# Altium schematic sheet top.SchDoc
size A4
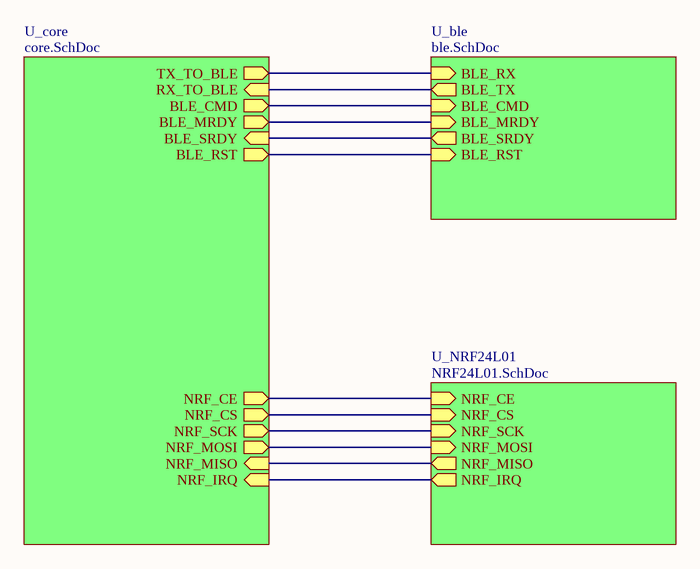
[diagram p0: top.SchDoc]

## Sub-sheets
U_ble = ble.SchDoc: BLE_RX (in), BLE_TX (out), BLE_CMD (in), BLE_MRDY (in), BLE_SRDY (out), BLE_RST (in)
U_core = core.SchDoc: NRF_CE (out), NRF_CS (out), NRF_SCK (out), NRF_MOSI (out), NRF_MISO (in), NRF_IRQ (in), RX_TO_BLE (in), TX_TO_BLE (out), BLE_CMD (out), BLE_MRDY (out), BLE_SRDY (in), BLE_RST (out)
U_NRF24L01 = NRF24L01.SchDoc: NRF_CE (in), NRF_CS (in), NRF_SCK (in), NRF_MOSI (in), NRF_MISO (out), NRF_IRQ (out)

## Nets
(unnamed): sheet U_ble/BLE_RX, sheet U_core/TX_TO_BLE
(unnamed): sheet U_ble/BLE_TX, sheet U_core/RX_TO_BLE
(unnamed): sheet U_ble/BLE_CMD, sheet U_core/BLE_CMD
(unnamed): sheet U_ble/BLE_MRDY, sheet U_core/BLE_MRDY
(unnamed): sheet U_ble/BLE_SRDY, sheet U_core/BLE_SRDY
(unnamed): sheet U_ble/BLE_RST, sheet U_core/BLE_RST
(unnamed): sheet U_core/NRF_CE, sheet U_NRF24L01/NRF_CE
(unnamed): sheet U_core/NRF_CS, sheet U_NRF24L01/NRF_CS
(unnamed): sheet U_core/NRF_SCK, sheet U_NRF24L01/NRF_SCK
(unnamed): sheet U_core/NRF_MOSI, sheet U_NRF24L01/NRF_MOSI
(unnamed): sheet U_core/NRF_MISO, sheet U_NRF24L01/NRF_MISO
(unnamed): sheet U_core/NRF_IRQ, sheet U_NRF24L01/NRF_IRQ